# EAGLE design feedback_device REV2 (EAGLE 9.6.2)
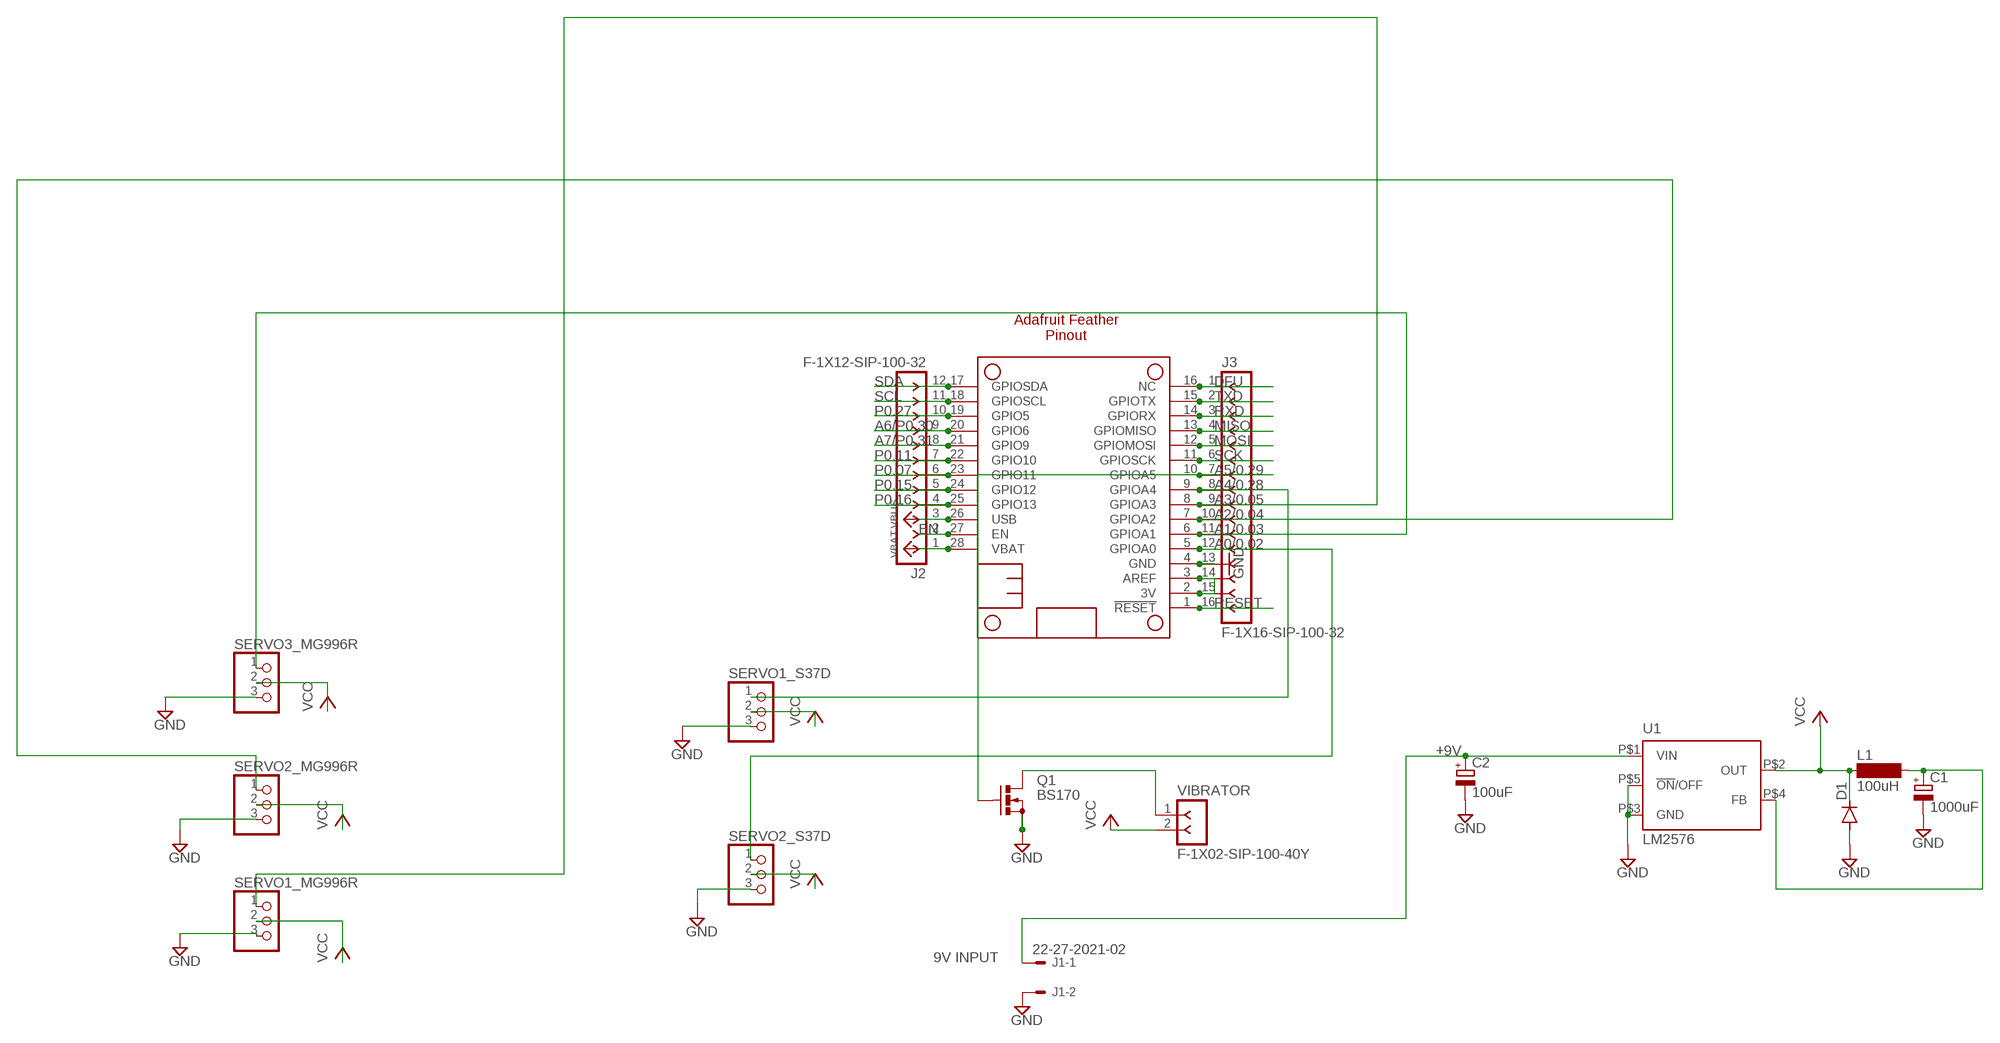
[diagram p0: schematic, sheet 1]

## Parts
C1  1000uF  CPOL-EUE5-8.5  [E5-8,5]
C2  100uF  CPOL-EUE2.5-7  [E2,5-7]
D1  DIODE-SMB  [SMB]
J1  22-27-2021-02  [6410-02]
J2  F-1X12-SIP-100-32  [SIP-100-12-32]
J3  F-1X16-SIP-100-32  [SIP-100-16-32]
L1  100uH  SD75  [SD75]
MS1  FEATHERWING_NODIM  [FEATHERWING_NODIM]
Q1  BS170  [SOT54E]
SERVO1_MG996R  PINHD-1X3  [1X03]
SERVO1_S37D  PINHD-1X3  [1X03]
SERVO2_MG996R  PINHD-1X3  [1X03]
SERVO2_S37D  PINHD-1X3  [1X03]
SERVO3_MG996R  PINHD-1X3  [1X03]
U1  LM2576  [LM2576]
VIBRATOR  F-1X02-SIP-100-40Y  [SIP-100-02-40Y]

## Nets
3V: J3.14 J3.15 MS1.2(3V) MS1.3(AREF)
A0/0.02: J3.12 MS1.5(GPIOA0) SERVO2_S37D.1
A1/0.03: J3.11 MS1.6(GPIOA1) SERVO3_MG996R.1
A2/0.04: J3.10 MS1.7(GPIOA2) SERVO2_MG996R.1
A3/0.05: J3.9 MS1.8(GPIOA3) SERVO1_MG996R.1
A4/0.28: J3.8 MS1.9(GPIOA4) SERVO1_S37D.1
A5/0.29: J3.7 MS1.10(GPIOA5) Q1.G
A6/P0.30: J2.9 MS1.20(GPIO6)
A7/P0.31: J2.8 MS1.21(GPIO9)
DFU: J3.1 MS1.16(NC)
EN: J2.2 MS1.27(EN)
GND: C1.- C2.- D1.A J1.2 J3.13 MS1.4(GND) Q1.S SERVO1_MG996R.3 SERVO1_S37D.3 SERVO2_MG996R.3 SERVO2_S37D.3 SERVO3_MG996R.3 U1.P$3(GND) U1.P$5(!ON!/OFF)
MISO: J3.4 MS1.13(GPIOMISO)
MOSI: J3.5 MS1.12(GPIOMOSI)
N$1: Q1.D VIBRATOR.1
N$2: C2.+ J1.1 U1.P$1(VIN)
N$5: C1.+ L1.2 U1.P$4(FB)
P0.07: J2.6 MS1.23(GPIO11)
P0.11: J2.7 MS1.22(GPIO10)
P0.15: J2.5 MS1.24(GPIO12)
P0.16: J2.4 MS1.25(GPIO13)
P0.27: J2.10 MS1.19(GPIO5)
RESET: J3.16 MS1.1(!RESET)
RXD: J3.3 MS1.14(GPIORX)
SCK: J3.6 MS1.11(GPIOSCK)
SCL: J2.11 MS1.18(GPIOSCL)
SDA: J2.12 MS1.17(GPIOSDA)
TXD: J3.2 MS1.15(GPIOTX)
VBAT: J2.1 MS1.28(VBAT)
VBUS: J2.3 MS1.26(USB)
VCC: D1.C L1.1 SERVO1_MG996R.2 SERVO1_S37D.2 SERVO2_MG996R.2 SERVO2_S37D.2 SERVO3_MG996R.2 U1.P$2(OUT) VIBRATOR.2

## Notes on the sheet
- Adafruit Feather
  Pinout
- +9V
- 9V INPUT

## Library data of the parts
C1 C2 = rcl:CPOL-EU: POLARIZED CAPACITOR, European symbol; SPICEPREFIX: C
D1 = diode:DIODE-: DIODE
J1 = con-molex:22-?-02: CONNECTOR wire to board 2.54 mm (.1 inch) pitch header; MF: MOLEX; OC_FARNELL: unknown; OC_NEWARK: unknown
J2 = con-headers-jp:F-1X12-: FEMALE HEADER
J3 = con-headers-jp:F-1X16-: FEMALE HEADER
L1 = inductor-neosid:SD75: INDUCTOR nominal inductance, E12; OC_FARNELL: unknown; OC_NEWARK: unknown
MS1 = microbuilder:FEATHERWING
Q1 = transistor-small-signal:BS170: N-CHANNEL MOS FET
SERVO1_MG996R SERVO1_S37D SERVO2_MG996R SERVO2_S37D SERVO3_MG996R = pinhead:PINHD-1X3: PIN HEADER
U1 = LM2576:LM2576
VIBRATOR = con-headers-jp:F-1X02-: FEMALE HEADER

## Board
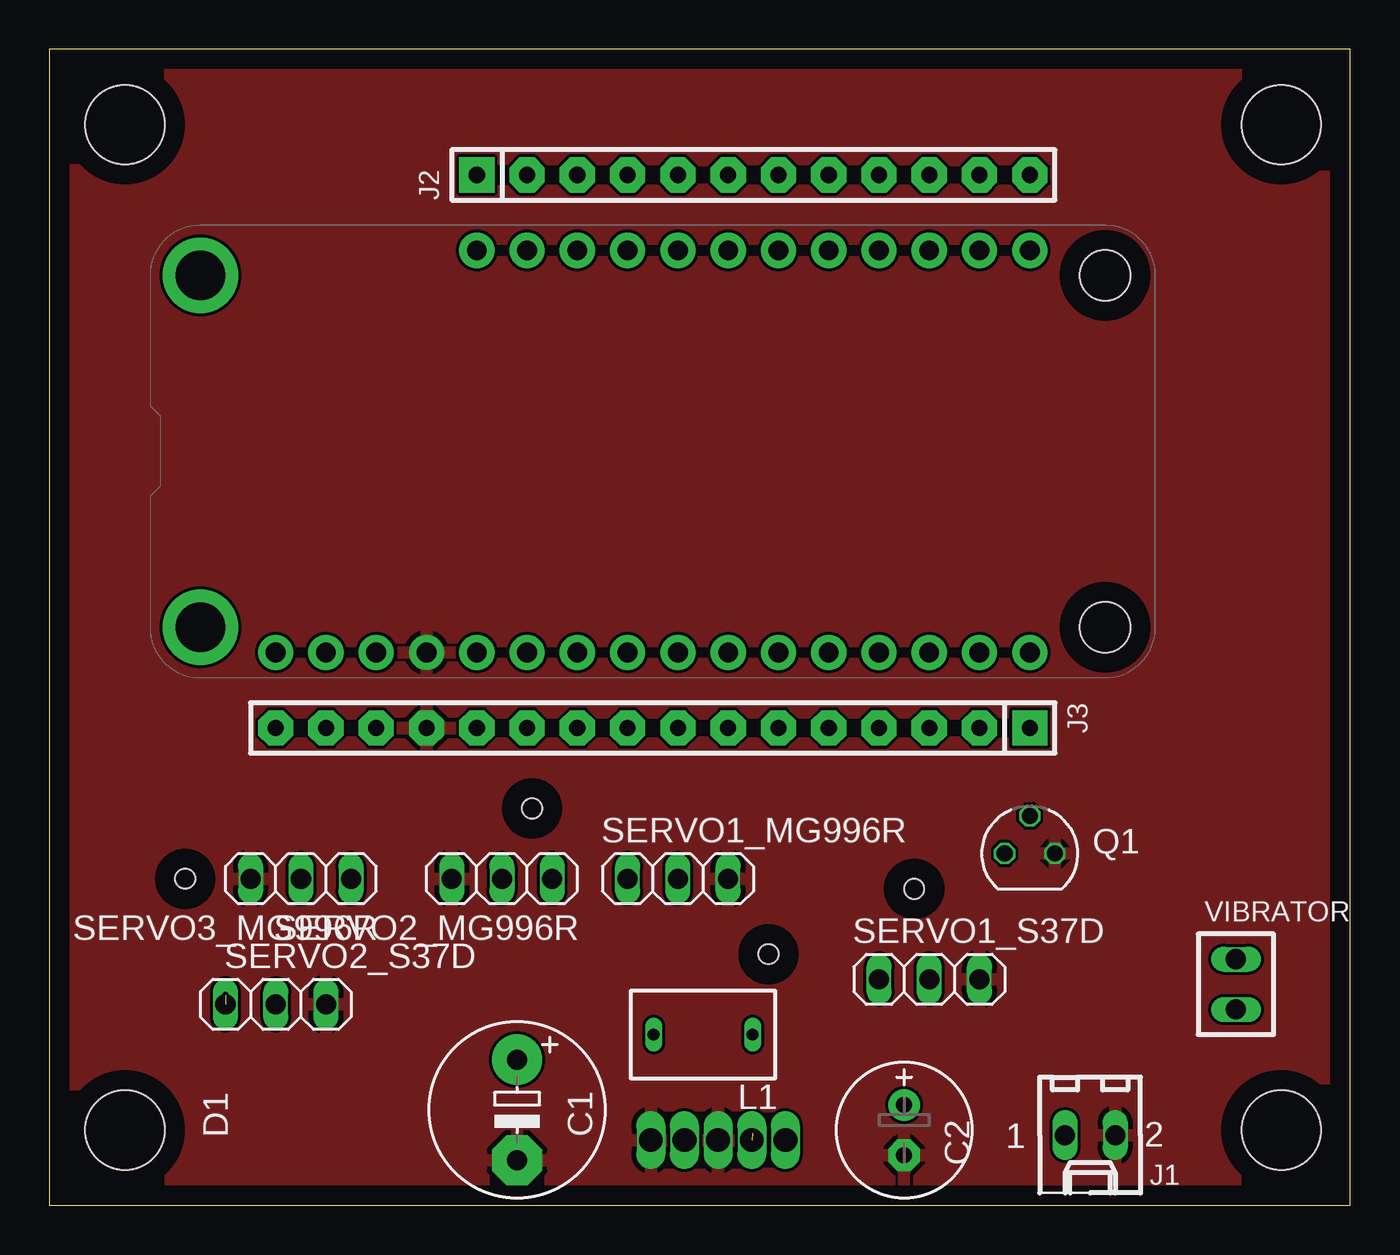
[diagram p1: board, top side]
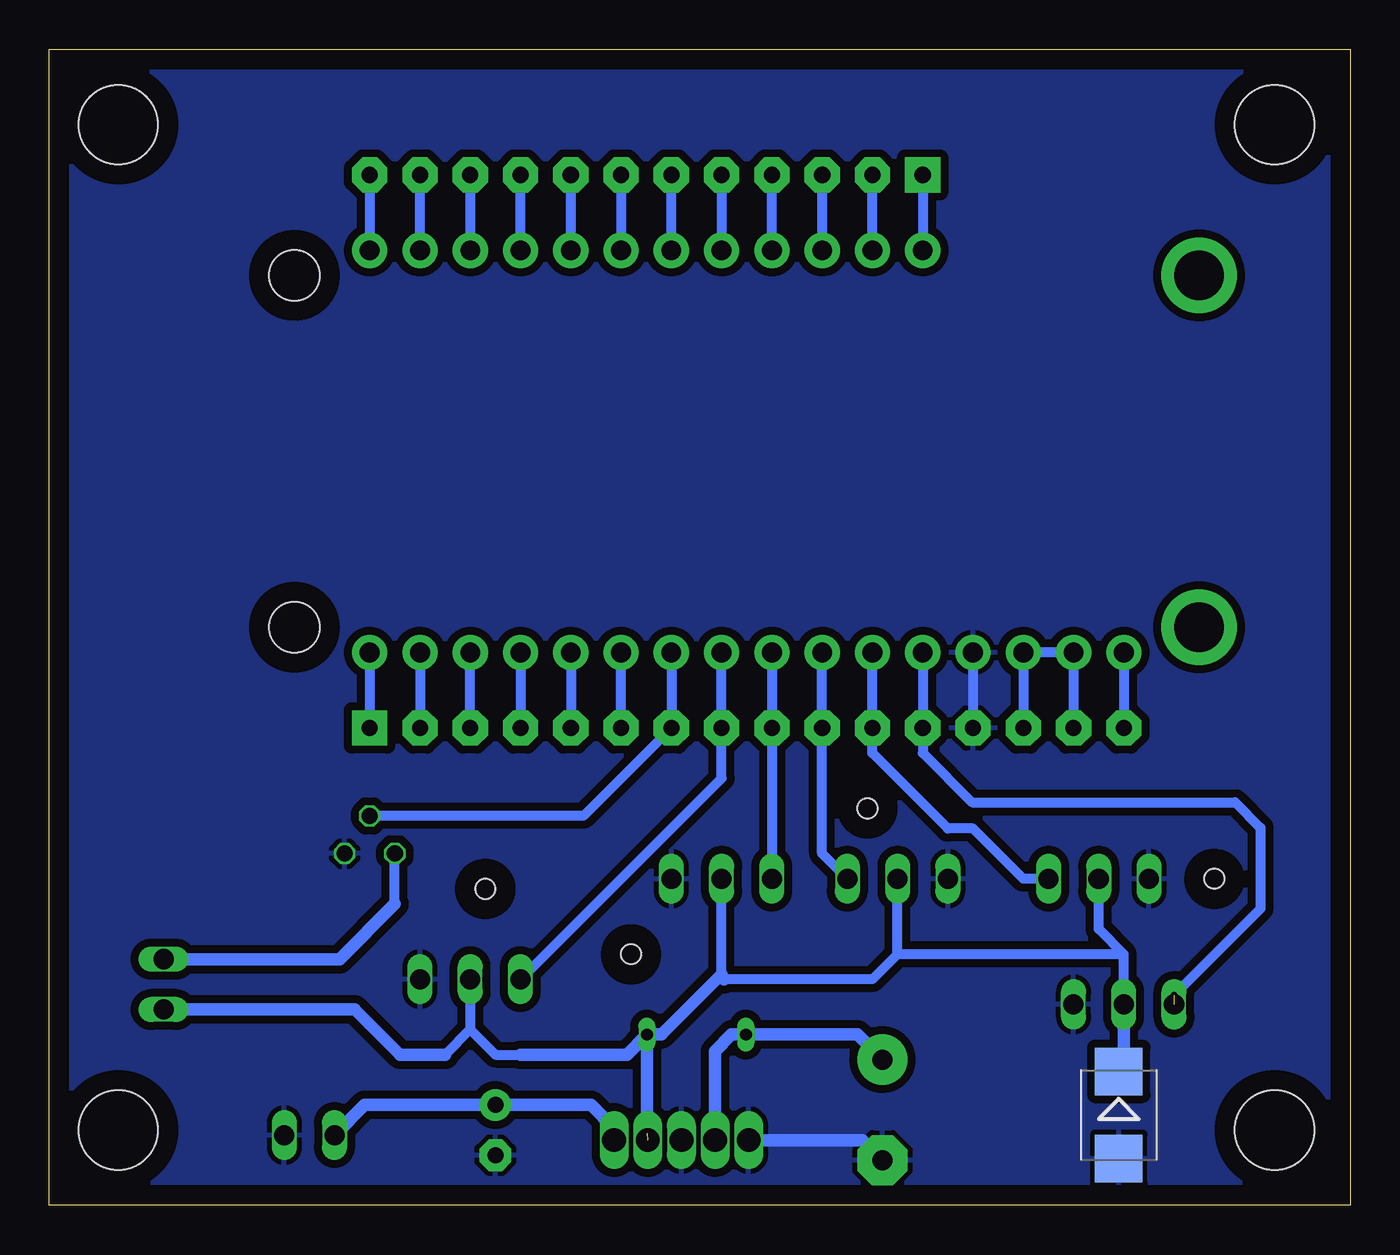
[diagram p2: board, bottom side, seen from below]

Size 65.71 x 58.41 mm. Coordinates in mm from the lower left corner, seen from the top.
Outline: 0,0 65.71,0 65.71,58.41 0,58.41 0,0
Copper layers (1*16): Top 0.035mm / dielectric 1.5mm / Bottom 0.035mm
Design rules "default *": minimum track width 6mil, minimum drill 0.8mm, track to track 6mil, track to pad 6mil, pad to pad 6mil, via to via 6mil, smd to smd 6mil, copper to edge 40mil, drill to drill 6mil, minimum pad ring 5mil, minimum via ring 8mil, stop-mask expansion 4mil, vias tented up to drill 0mil, thermal gap 10mil
Holes 4 mm at 3.81,3.81 62.23,3.81 62.23,54.61 3.81,54.61
Holes 1 mm at 6.86,16.51 24.38,20.07 43.69,16 36.32,12.7

### Footprints (pad centres in the part's own frame; a part is rotated, then mirrored left to right if it is on the bottom)
E5-8,5 = drill 1.016 pad 2.54: + -2.54,0 | drill 1.016 pad 2.54 octagon: - 2.54,0
E2,5-7 = drill 0.813 pad 1.6: + -1.27,0 | drill 0.813 pad 1.6 octagon: - 1.27,0
SMB = smd 2.4 x 2.4: A 2.2,0; C -2.2,0
6410-02 = drill 1.016 long: 1 1.27,0; 2 -1.27,0
SIP-100-12-32 = drill 0.813 pad 1.778 square: 1 -13.97,0 | drill 0.813 pad 1.778 octagon: 2 -11.43,0; 3 -8.89,0; 4 -6.35,0; 5 -3.81,0; 6 -1.27,0; 7 1.27,0; 8 3.81,0; 9 6.35,0; 10 8.89,0; 11 11.43,0; 12 13.97,0
SIP-100-16-32 = drill 0.813 pad 1.778 square: 1 -19.05,0 | drill 0.813 pad 1.778 octagon: 2 -16.51,0; 3 -13.97,0; 4 -11.43,0; 5 -8.89,0; 6 -6.35,0; 7 -3.81,0; 8 -1.27,0; 9 1.27,0; 10 3.81,0; 11 6.35,0; 12 8.89,0; 13 11.43,0; 14 13.97,0; 15 16.51,0; 16 19.05,0
SD75 = drill 0.6 long: 1 -2.5,0; 2 2.5,0
FEATHERWING_NODIM = drill 1 pad 1.778: 1 6.35,1.27; 2 8.89,1.27; 3 11.43,1.27; 4 13.97,1.27; 5 16.51,1.27; 6 19.05,1.27; 7 21.59,1.27; 8 24.13,1.27; 9 26.67,1.27; 10 29.21,1.27; 11 31.75,1.27; 12 34.29,1.27; 13 36.83,1.27; 14 39.37,1.27; 15 41.91,1.27; 16 44.45,1.27; 17 44.45,21.59; 18 41.91,21.59; 19 39.37,21.59; 20 36.83,21.59; 21 34.29,21.59; 22 31.75,21.59; 23 29.21,21.59; 24 26.67,21.59; 25 24.13,21.59; 26 21.59,21.59; 27 19.05,21.59; 28 16.51,21.59 | drill 2.5 pad 3.81: P$1 2.54,20.32; P$2 2.54,2.54 | hole 2.54: 48.26,20.32; 48.26,2.54
SOT54E = drill 0.813 octagon: D -1.27,0; G 0,1.905; S 1.27,0
1X03 = drill 1.016 long: 1 -2.54,0; 2 0,0; 3 2.54,0
LM2576 = drill 1.2 pad 1.27 long: P$1 -3.4,0; P$2 -1.7,0; P$3 0,0; P$4 1.7,0; P$5 3.4,0
SIP-100-02-40Y = drill 1.016 long: 1 -1.27,0; 2 1.27,0

### Placement (x,y rotation side)
C1  23.62,4.83 270 top
C2  43.18,3.81 270 top
D1  11.68,4.57 270 bottom
J1  52.58,3.56 180 top
J2  35.56,52.07 0 top
J3  30.48,24.13 180 top
L1  33.02,8.64 180 top
MS1  5.08,26.67 0 top
Q1  49.53,17.78 0 top
SERVO1_MG996R  31.75,16.51 0 top
SERVO1_S37D  44.45,11.43 0 top
SERVO2_MG996R  22.86,16.51 180 top
SERVO2_S37D  11.43,10.16 0 top
SERVO3_MG996R  12.7,16.51 180 top
U1  33.78,3.3 180 top
VIBRATOR  59.94,11.18 270 top

### Tracks (layer width: path | path; a pad name or v marks a point on that pad's centre or on a via)
3V
  Bottom 0.508: J3.15 MS1.2 MS1.3 J3.14
A0/0.02  (via drill 0.35)  (1 unrouted)
  Bottom 0.508: MS1.5 J3.12 21.59,22.86 19.1,20.37 5.8,20.37 4.52,19.09 4.52,14.99 v8.89,10.62
A1/0.03
  Bottom 0.508: MS1.6 J3.11 24.13,22.86 20.32,19.05 19.05,19.05 16.51,16.51 SERVO3_MG996R.1
A2/0.04
  Bottom 0.508: MS1.7 J3.10 26.67,17.78 SERVO2_MG996R.1
A3/0.05
  Bottom 0.508: MS1.8 J3.9 SERVO1_MG996R.1
A4/0.28
  Bottom 0.508: MS1.9 J3.8 31.75,21.59 SERVO1_S37D.1
A5/0.29
  Bottom 0.508: MS1.10 J3.7 38.73,19.68 Q1.G
A6/P0.30
  Bottom 0.508: MS1.20 J2.9
A7/P0.31
  Bottom 0.508: MS1.21 J2.8
DFU
  Bottom 0.508: MS1.16 J3.1
EN
  Bottom 0.508: MS1.27 J2.2
GND
  Bottom 0.508: MS1.4 J3.13
  Bottom 0.635: C1.- 24.64,3.3 U1.P$5
  pour Bottom (isolate 0.406): -2.29,62.74 -2.29,-2.54 68.83,-2.54 68.83,62.74
  pour Top: -4.32,65.28 71.37,65.28 71.37,58.17 71.37,-6.1 0.51,-6.1 -4.32,-6.1
MISO
  Bottom 0.508: MS1.13 J3.4
MOSI
  Bottom 0.508: MS1.12 J3.5
N$1
  Bottom 0.508: 48.26,15.24 Q1.D
  Bottom 0.635: VIBRATOR.1 51.05,12.45 48.26,15.24
N$2
  Bottom 0.635: J1.1 49.78,5.08 C2.+ 38.36,5.08 37.18,3.9 U1.P$1
N$5
  Bottom 0.635: C1.+ 24.89,8.64 L1.2 31.24,8.64 32.08,7.8 U1.P$4
P0.07
  Bottom 0.508: MS1.23 J2.6
P0.11
  Bottom 0.508: J2.7 MS1.22
P0.15
  Bottom 0.508: J2.5 MS1.24
P0.16
  Bottom 0.508: MS1.25 J2.4
P0.27
  Bottom 0.508: J2.10 MS1.19
RESET
  Bottom 0.508: MS1.1 J3.16
RXD
  Bottom 0.508: J3.3 MS1.14
SCK
  Bottom 0.508: J3.6 MS1.11
SCL
  Bottom 0.508: MS1.18 J2.11
SDA
  Bottom 0.508: J2.12 MS1.17
TXD
  Bottom 0.508: MS1.15 J3.2
VBAT
  Bottom 0.508: J2.1 MS1.28
VBUS
  Bottom 0.508: J2.3 MS1.26
VCC  (1 unrouted)
  Bottom 0.508: 31.75,11.56 31.75,11.68 SERVO1_MG996R.2 | SERVO2_S37D.2 11.43,12.7 | 11.43,12.7 12.7,13.97 SERVO3_MG996R.2 | 22.86,12.7 24.13,11.43 31.62,11.43 | 22.86,12.7 SERVO2_MG996R.2 | 11.43,12.7 22.86,12.7 | 41.91,7.62 43.18,7.62 44.45,8.89 | SERVO1_S37D.2 44.45,8.89 | 44.45,8.89 45.72,7.62
  Bottom 0.635: 31.62,11.43 31.75,11.56 | D1.C 11.43,7.03 SERVO2_S37D.2 | L1.1 35.52,3.64 | 45.72,7.62 48.01,7.62 50.29,9.91 VIBRATOR.2 | 41.91,7.62 36.54,7.62 L1.1 | 31.75,11.68 34.8,8.64 L1.1